# Altium project BuckV3.PrjPCB
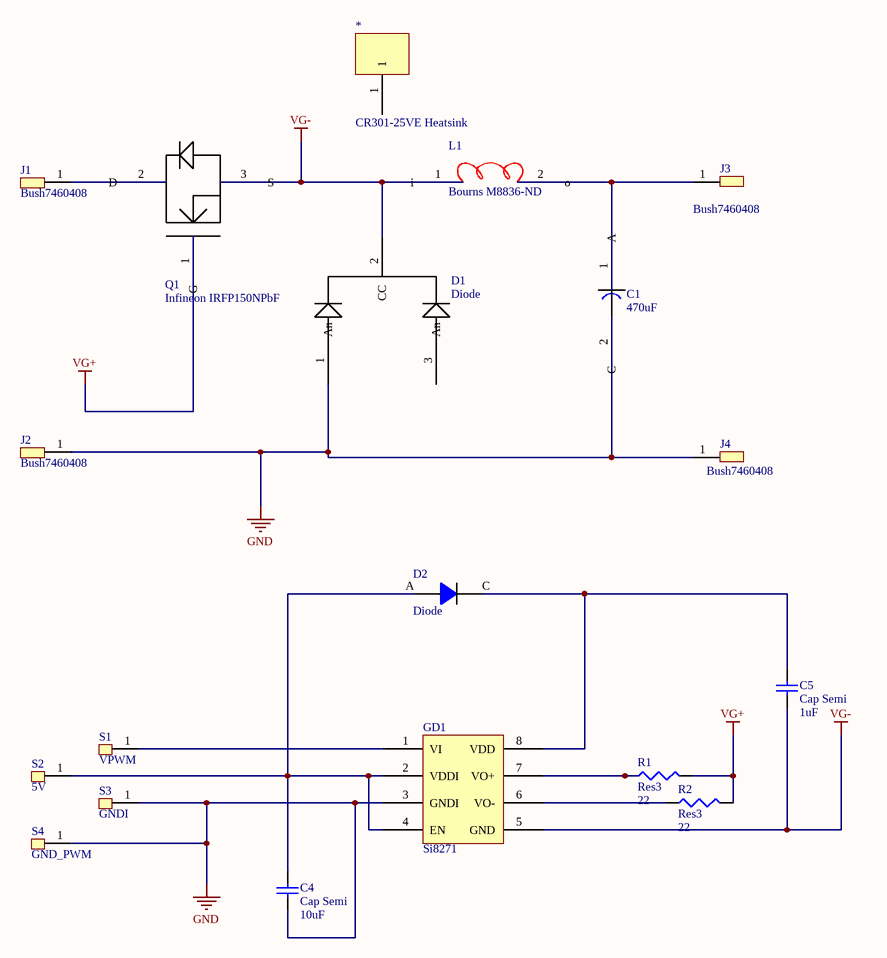
[diagram p0: Buckv5.SchDoc]
1 sheet, 19 parts. Net scope: global (net labels, ports and power ports of the same name join across sheets).
Board files: Buckv7.PcbDoc, Buckv8.PcbDoc

## Sheet Buckv5.SchDoc
size A4

### Parts
*  CR301-25VE Heatsink  [CR301-25VE]
C1  470uF  [EPCOS TDK B4851]
C4  Cap Semi  value 10uF  [C1210]
C5  Cap Semi  value 1uF  [C1210]
D1  Diode  [TO-247AC]
D2  Diode  [SOD128Diode]
GD1  Si8271  [IPC-7351 SOIC127P600X173-8N]
J1  Bush7460408  [Bush7460408]
J2  Bush7460408  [Bush7460408]
J3  Bush7460408  [Bush7460408]
J4  Bush7460408  [Bush7460408]
L1  Bourns M8836-ND  [Bourns M8836-ND]
Q1  Infineon IRFP150NPbF  [Infineon IRFP150NPbF]
R1  Res3  value 22  [14-1210]
R2  Res3  value 22  [14-1210]
S1  VPWM  [Sensor_Connecter]
S2  5V  [Sensor_Connecter]
S3  GNDI  [Sensor_Connecter]
S4  GND_PWM  [Sensor_Connecter]

### Nets
GND: C1.2(C) C4.1 D1.1(An) GD1.3(GNDI) J2.1 J4.1 S3.1 S4.1
VG+: Q1.1(G) R1.2 R2.2
VG-: C5.1 D1.2(CC) GD1.5(GND) L1.1(i) Q1.3(S)
NetC1_1: C1.1(A) J3.1 L1.2(o)
NetC4_2: C4.2 D2.A GD1.2(VDDI) GD1.4(EN) S2.1
NetC5_2: C5.2 D2.C GD1.8(VDD)
NetGD1_1: GD1.1(VI) S1.1
NetGD1_6: GD1.6(VO-) R2.1
NetGD1_7: GD1.7(VO+) R1.1
NetJ1_1: J1.1 Q1.2(D)

Not connected (* = marked no-connect by the designer): * 1; D1 3(An)

### Library data of the parts
* = CR301-25VE Heatsink: Ohmite Heatsink   CR301-25VE Mouser 588-CR301-25VE
C4 = Cap Semi: CAP CER 10UF 50V X7S 1210 @Digikey 445-4537-1-ND or C3225X7S1H106M250AB; Published: 8-Jun-2000; LatestRevisionDate: 29-May-2009; LatestRevisionNote: IPC-7351 Footprint Added.; PackageReference: C1206; Publisher: Altium Limited; PackageDescription: Chip Capacitor
C5 = Cap Semi: Samsung Electro-Mechanics CAP Ceramic 1uF 50V Digikey 1276-1811-1-ND; Published: 8-Jun-2000; LatestRevisionDate: 29-May-2009; LatestRevisionNote: IPC-7351 Footprint Added.; PackageReference: C1206; Publisher: Altium Limited; PackageDescription: Chip Capacitor
D1 = Vishay Semiconductors VS-STPS30L60CW-N3: Vishay Semiconductors Schottky Rectifier Diode / Digikey VS-STPS30L60CW-N3GI-ND
D2 = Diode: Schottky Diode 30V 5A / Digikey 568-6519-1-ND
GD1 = Si8271: 8-Pin Gate Driver
R1 R2 = Res3: Stackpole Electronics Resistor 22 Ohms / 0.5W Digikey RMCF1210JT22R0TR-ND; Published: 8-Jun-2000; LatestRevisionDate: 29-May-2009; LatestRevisionNote: IPC-7351 Footprint Added.; PackageReference: J1-0603; Publisher: Altium Limited; PackageDescription: Chip Resistor
S1-S4 = Sensor_Connecter: Sensor Connecter